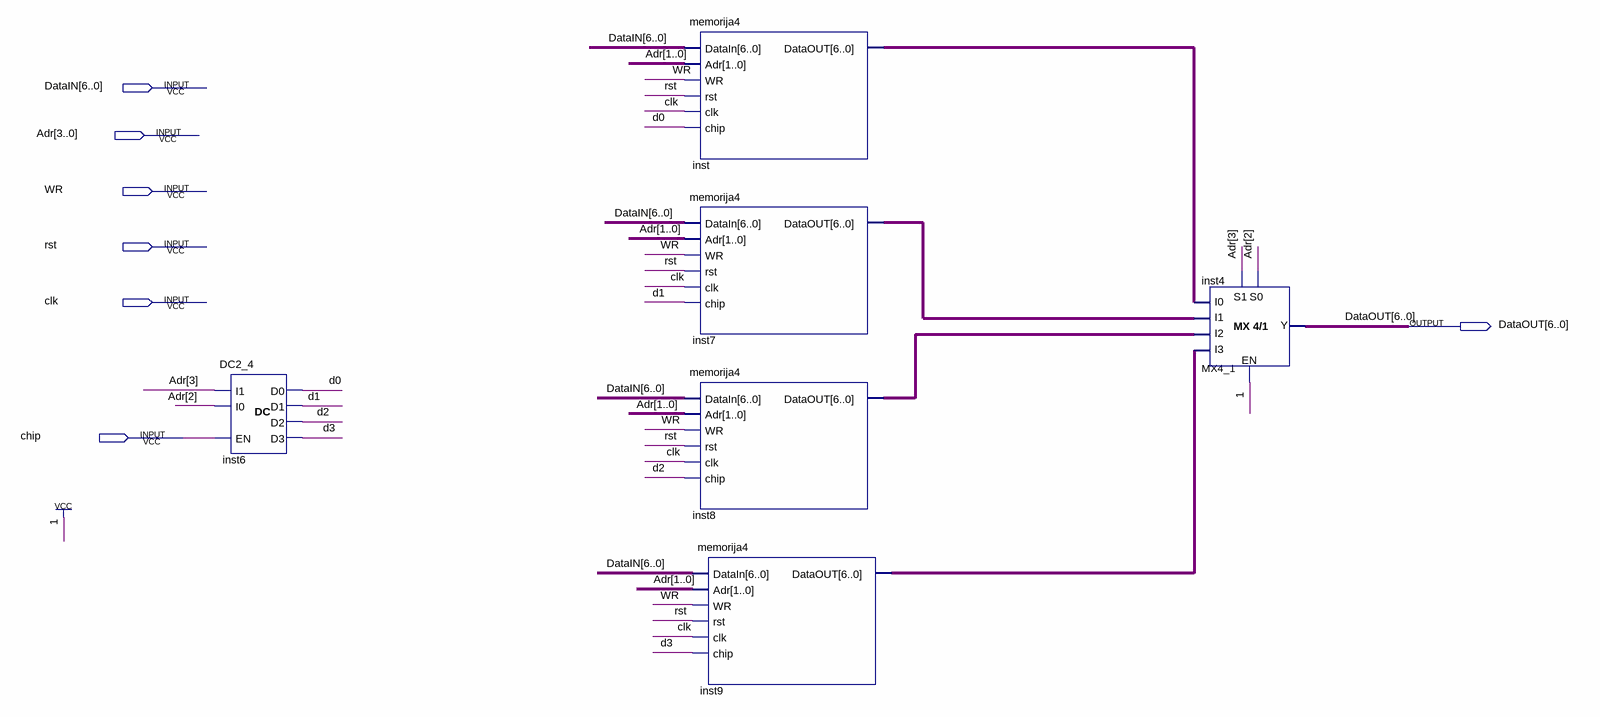
[diagram p0: schematic sheet]
// Quartus schematic memorija16.bdf as structural Verilog: 6 symbols, 7 pins
module memorija16 (
  input  [6:0] DataIN,
  input  [3:0] Adr,
  input  WR,
  input  rst,
  input  clk,
  input  chip,
  output [6:0] DataOUT
);

  wire d0, d1, d2, d3;
  wire [6:0] inst7_dataout, inst8_dataout, inst9_dataout, inst_dataout;

  DC2_4 inst6 (.I0(Adr[2]), .I1(Adr[3]), .EN(chip), .D0(d0), .D1(d1), .D2(d2), .D3(d3));
  memorija4 inst (.DataIn(DataIN), .Adr(Adr[1:0]), .WR(WR), .rst(rst), .clk(clk), .chip(d0), .DataOUT(inst_dataout));
  memorija4 inst7 (.DataIn(DataIN), .Adr(Adr[1:0]), .WR(WR), .rst(rst), .clk(clk), .chip(d1), .DataOUT(inst7_dataout));
  memorija4 inst8 (.DataIn(DataIN), .Adr(Adr[1:0]), .WR(WR), .rst(rst), .clk(clk), .chip(d2), .DataOUT(inst8_dataout));
  memorija4 inst9 (.DataIn(DataIN), .Adr(Adr[1:0]), .WR(WR), .rst(rst), .clk(clk), .chip(d3), .DataOUT(inst9_dataout));
  MX4_1 inst4 (
    .S1(Adr[3]), .S0(Adr[2]), .EN(1'b1), .I3(inst9_dataout), .I2(inst8_dataout), .I1(inst7_dataout),
    .I0(inst_dataout), .Y(DataOUT));
endmodule
